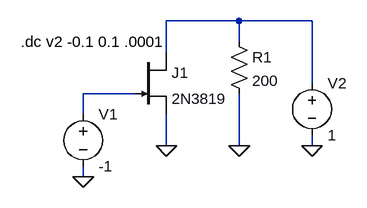
[diagram p0: schematic Draft3.asc]
Draft3.asc, the LTspice schematic file:
Version 4
SHEET 1 880 680
WIRE 384 96 272 96
WIRE 496 96 384 96
WIRE 384 128 384 96
WIRE 272 144 272 96
WIRE 496 192 496 96
WIRE 224 208 144 208
WIRE 144 240 144 208
WIRE 272 288 272 240
WIRE 384 288 384 208
WIRE 496 288 496 272
WIRE 144 336 144 320
FLAG 144 336 0
FLAG 272 288 0
FLAG 496 288 0
FLAG 384 288 0
SYMBOL voltage 144 224 R0
WINDOW 123 0 0 Left 2
WINDOW 39 0 0 Left 2
SYMATTR InstName V1
SYMATTR Value -1
SYMBOL voltage 496 176 R0
WINDOW 123 0 0 Left 2
WINDOW 39 0 0 Left 2
SYMATTR InstName V2
SYMATTR Value 1
SYMBOL res 368 112 R0
SYMATTR InstName R1
SYMATTR Value 200
SYMBOL njf 224 144 R0
SYMATTR InstName J1
SYMATTR Value 2N3819
TEXT 48 128 Left 2 !.dc v2 -0.1 0.1 .0001

The netlist it stands for:
* Draft3.asc
V1 N002 0 -1
V2 N001 0 1
R1 N001 0 200
J1 N001 N002 0 2N3819
.model NJF NJF
.model PJF PJF
.lib standard.jft
.dc v2 -0.1 0.1 .0001
.backanno
.end